# EAGLE schematic breakout1 (EAGLE 6.6.0)
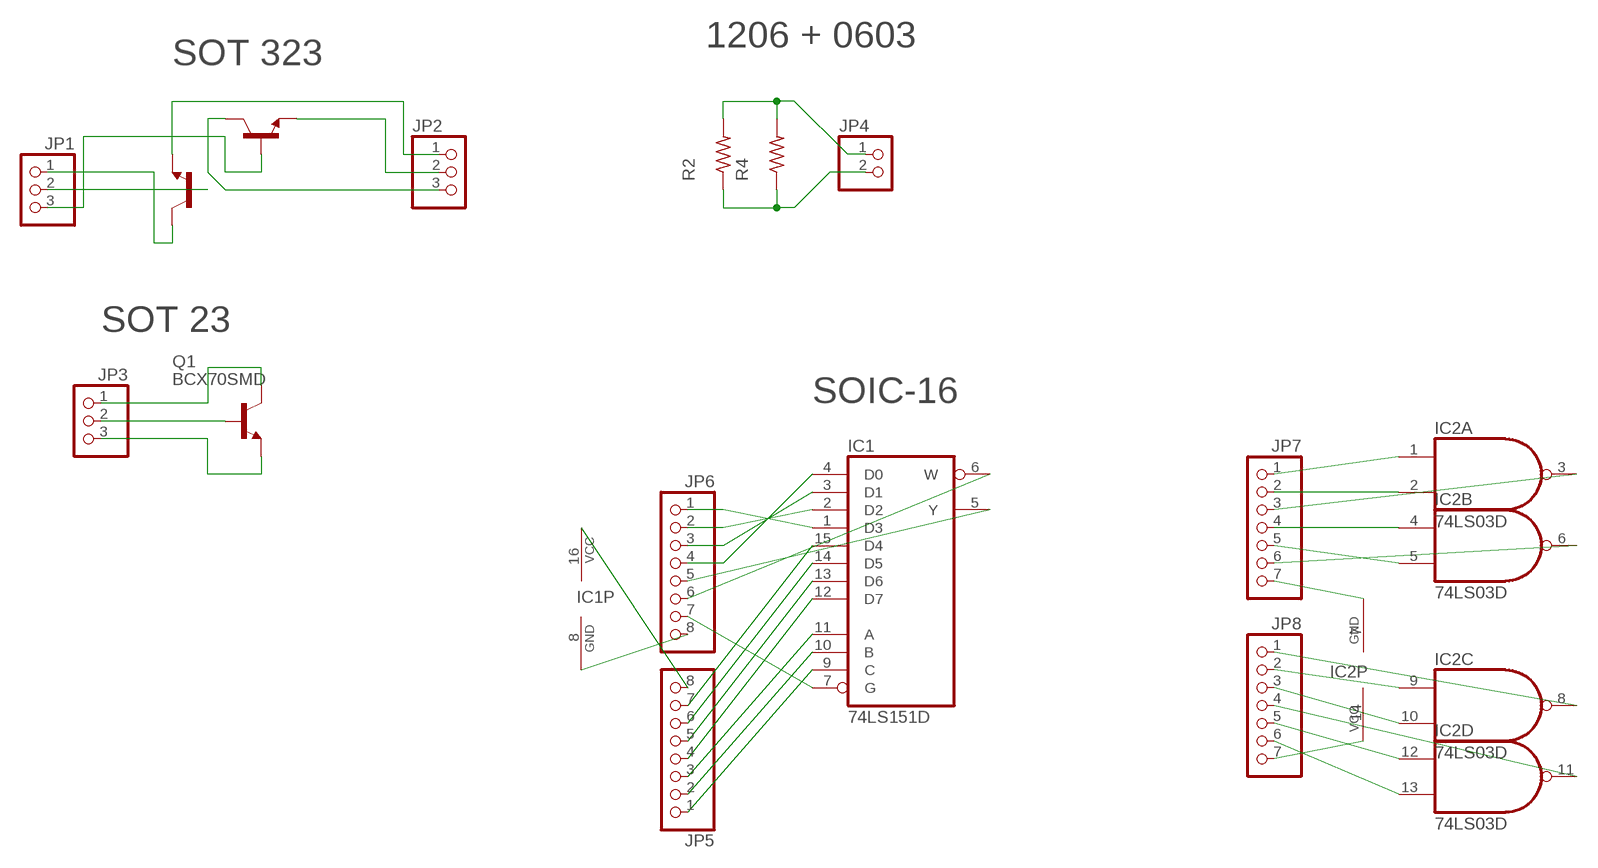
[diagram p0: schematic, sheet 1]

## Parts
IC1  74LS151D  [SO16]
IC2  74LS03D  [SO14]
JP1  PINHD-1X3  [1X03]
JP2  PINHD-1X3  [1X03]
JP3  PINHD-1X3  [1X03]
JP4  PINHD-1X2  [1X02]
JP5  PINHD-1X8  [1X08]
JP6  PINHD-1X8  [1X08]
JP7  PINHD-1X7  [1X07]
JP8  PINHD-1X7  [1X07]
Q1  BCX70SMD  [SOT23]
R2  R-US_R0603  [R0603]
R4  R-US_R1206  [R1206]
U$1  DMMT3904W  [SOT363]

## Nets
N$1: JP1.3 U$1.1(A:B)
N$2: JP1.2 U$1.2(B:B)
N$3: JP1.1 U$1.3(B:C)
N$4: JP2.1 U$1.4(B:E)
N$5: JP2.2 U$1.5(A:E)
N$6: JP2.3 U$1.6(A:C)
N$8: JP3.2 Q1.1(B)
N$9: JP3.1 Q1.3(C)
N$10: JP3.3 Q1.2(E)
N$11: JP4.1 R2.2 R4.2
N$12: JP4.2 R2.1 R4.1
N$13: IC1.1(D3) JP6.1
N$14: IC1.2(D2) JP6.2
N$15: IC1.3(D1) JP6.3
N$16: IC1.4(D0) JP6.4
N$17: IC1.7(G) JP6.7
N$18: IC1.5(Y) JP6.5
N$19: IC1.6(W) JP6.6
N$20: IC1.8(GND) JP6.8
N$21: IC1.9(C) JP5.1
N$22: IC1.10(B) JP5.2
N$23: IC1.11(A) JP5.3
N$24: IC1.12(D7) JP5.4
N$25: IC1.13(D6) JP5.5
N$26: IC1.14(D5) JP5.6
N$27: IC1.15(D4) JP5.7
N$28: IC1.16(VCC) JP5.8
N$29: IC2.1(A:I0) JP7.1
N$31: IC2.2(A:I1) JP7.2
N$32: IC2.4(B:I0) JP7.4
N$33: IC2.5(B:I1) JP7.5
N$34: IC2.6(B:O) JP7.6
N$35: IC2.3(A:O) JP7.3
N$36: IC2.8(C:O) JP8.1
N$37: IC2.9(C:I0) JP8.2
N$38: IC2.10(C:I1) JP8.3
N$39: IC2.11(D:O) JP8.4
N$40: IC2.12(D:I0) JP8.5
N$41: IC2.13(D:I1) JP8.6
N$42: IC2.14(P:VCC) JP8.7
N$43: IC2.7(P:GND) JP7.7

## Notes on the sheet
- 1206 + 0603
- SOT 323
- SOT 23
- SOIC-16

## Library data of the parts
IC1 = 74xx-us:74*151: Data SELECTOR/MULTIPLEXER
IC2 = 74xx-us:74*03: Quad 2-input NAND gate, open collector output
JP1-JP3 = pinhead:PINHD-1X3: PIN HEADER
JP4 = pinhead:PINHD-1X2: PIN HEADER
JP5 JP6 = pinhead:PINHD-1X8: PIN HEADER
JP7 JP8 = pinhead:PINHD-1X7: PIN HEADER
Q1 = transistor-npn:BCX70*: NPN Transistor
R2 R4 = rcl:R-US_: RESISTOR, American symbol
U$1 = !synth_sch:DMMT3904W